# EAGLE design untitled (EAGLE 9.6.2)
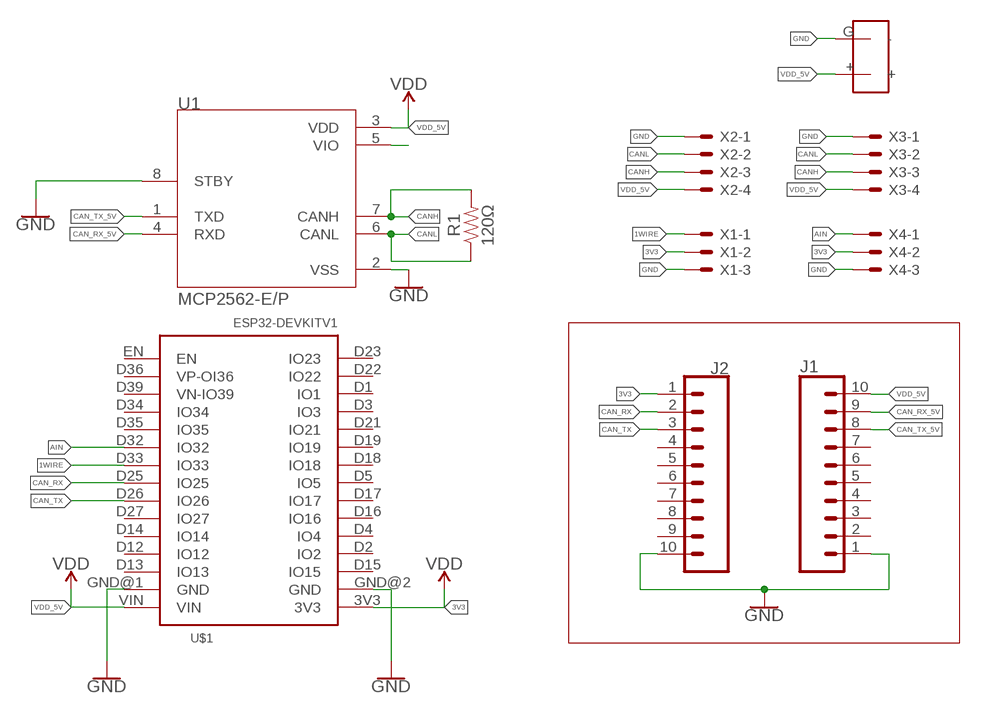
[diagram p0: schematic, sheet 1]

## Parts
J1  CONN_10"  [1X10]
J2  CONN_10"  [1X10]
R1  120Ω  RESISTORAXIAL-0.3  [AXIAL-0.3]
U1  MCP2562-E/P  [DIP787W45P254L1016H533Q8]
U$1  ESP32DEVKITV1  [ESP32-DEVKITV1]
U$2  BAT  [BAT]
X1  JST-XH-03-PIN-LONG-PAD  [JST-XH-03-PACKAGE-LONG-PAD]
X2  JST-XH-04-PIN-LONG-PAD  [JST-XH-04-PACKAGE-LONG-PAD]
X3  JST-XH-04-PIN-LONG-PAD  [JST-XH-04-PACKAGE-LONG-PAD]
X4  JST-XH-03-PIN-LONG-PAD  [JST-XH-03-PACKAGE-LONG-PAD]

## Nets
1WIRE: U$1.D33(IO33) X1.1
3V3: J2.1 U$1.3V3 X1.2 X4.2 ; supply symbol labelled VDD
AIN: U$1.D32(IO32) X4.1
CAN_RX: J2.2 U$1.D25(IO25)
CAN_RX_5V: J1.9 U1.4(RXD)
CAN_TX: J2.3 U$1.D26(IO26)
CAN_TX_5V: J1.8 U1.1(TXD)
CANH: R1.P$2 U1.7(CANH) X2.3 X3.3
CANL: R1.P$1 U1.6(CANL) X2.2 X3.2
GND: J1.1 J2.10 U1.2(VSS) U1.8(STBY) U$1.GND@1(GND) U$1.GND@2(GND) U$2.G(-) X1.3 X2.1 X3.1 X4.3
N$7: U1.5(VIO)
VDD_5V: J1.10 U1.3(VDD) U$1.VIN U$2.+ X2.4 X3.4 ; supply symbol labelled VDD
Unconnected: J1.2 J1.3 J1.4 J1.5 J1.6 J1.7 J2.4 J2.5 J2.6 J2.7 J2.8 J2.9 U$1.D1(IO1) U$1.D2(IO2) U$1.D3(IO3) U$1.D4(IO4) U$1.D5(IO5) U$1.D12(IO12) U$1.D13(IO13) U$1.D14(IO14) U$1.D15(IO15) U$1.D16(IO16) U$1.D17(IO17) U$1.D18(IO18) U$1.D19(IO19) U$1.D21(IO21) U$1.D22(IO22) U$1.D23(IO23) U$1.D27(IO27) U$1.D34(IO34) U$1.D35(IO35) U$1.D36(VP-OI36) U$1.D39(VN-IO39) U$1.EN

## Library data of the parts
J1 J2 = SparkFun-Connectors:CONN_10: Multi connection point. Often used as Generic Header-pin footprint for 0.1 inch spaced/style header connections On any of the 0.1 inch spaced packages, you can populate with these: Break Away Headers - Straight <https://www.sparkfun.com/products/116> (PRT-00116) Break Away Male Headers - Right Angle <https://www.sparkfun.com/products/553> (PRT-00553) Female Headers <https://www.sparkfun.com/products/115> (PRT-00115) Break Away Headers - Machine Pin <https://www.sparkfun.com/products/117> (PRT-00117) Break Away Female Headers - Swiss Machine Pin <https://www.sparkfun.com/products/743> (PRT-00743) Arduino Stackable Header - 10 Pin <https://www.sparkfun.com/products/11376> (PRT-11376) For SCREWTERMINALS and SPRING TERMINALS visit here: Screw Terimnals on SparkFun.com <https://www.sparkfun.com/search/results?term=Screw+Terminals> (5mm/3.5mm/2.54mm spacing) This device is also useful as a general connection point to wire up your design to another part of your project. Our various solder wires solder well into these plated through hole pads. Hook-Up Wire - Assortment (Stranded, 22 AWG) <https://www.sparkfun.com/products/11375> (PRT-11375) Hook-Up Wire - Assortment (Solid Core, 22 AWG) <https://www.sparkfun.com/products/11367> (PRT-11367) View the entire wire category on our website here <https://www.sparkfun.com/categories/141> Special notes: Molex polarized connector foot print use with SKU : PRT-08231 with associated crimp pins and housings. 1MM SMD Version SKU: PRT-10208 NOTES ON THE VARIANTS LOCK and LOCK_LONGPADS... This footprint was designed to help hold the alignment of a through-hole component (i.e. 6-pin header) while soldering it into place. You may notice that each hole has been shifted either up or down by 0.005 of an inch from it's more standard position (which is a perfectly straight line). This slight alteration caused the pins (the squares in the middle) to touch the edges of the holes. Because they are alternating, it causes a "brace" to hold the component in place. 0.005 has proven to be the perfect amount of "off-center" position when using our standard breakaway headers. Although looks a little odd when you look at the bare footprint, once you have a header in there, the alteration is very hard to notice. Also,if you push a header all the way into place, it is covered up entirely on the bottom side.; PROD_ID: CONN-11563
R1 = SparkFun-Resistors:RESISTOR: Generic Resistor Package
U1 = MCP2562-E_P:MCP2562-E/P: Integrated circuit: transceiver CAN; Channels: 1; 1Mbps; DIP8 Check availability <https://pricing.snapeda.com/parts/MCP2562-E/P/Microchip/view-part?ref=eda>; AVAILABILITY: In Stock; DESCRIPTION: 1/1 Transceiver Half CANbus 8-PDIP; MF: Microchip; MP: MCP2562-E/P; PACKAGE: DIP-8 Microchip; PRICE: None; PURCHASE-URL: https://pricing.snapeda.com/search/part/MCP2562-E/P/?ref=eda
U$1 = ESP32-DEVKITV1:ESP32DEVKITV1
U$2 = BAT:BAT
X1 X4 = JST XH Connectors:JST-XH-03-PIN: JST XH Connector 2 Pin Wire to board connector. Pitch: 2,54 mm, (0.100") Number of pins: 3 Created by Rembrandt Electronics www.rembrandtelectronics.com
X2 X3 = JST XH Connectors:JST-XH-04-PIN: JST XH Connector 2 Pin Wire to board connector. Pitch: 2,54 mm, (0.100") Number of pins: 4 Created by Rembrandt Electronics www.rembrandtelectronics.com

## Board
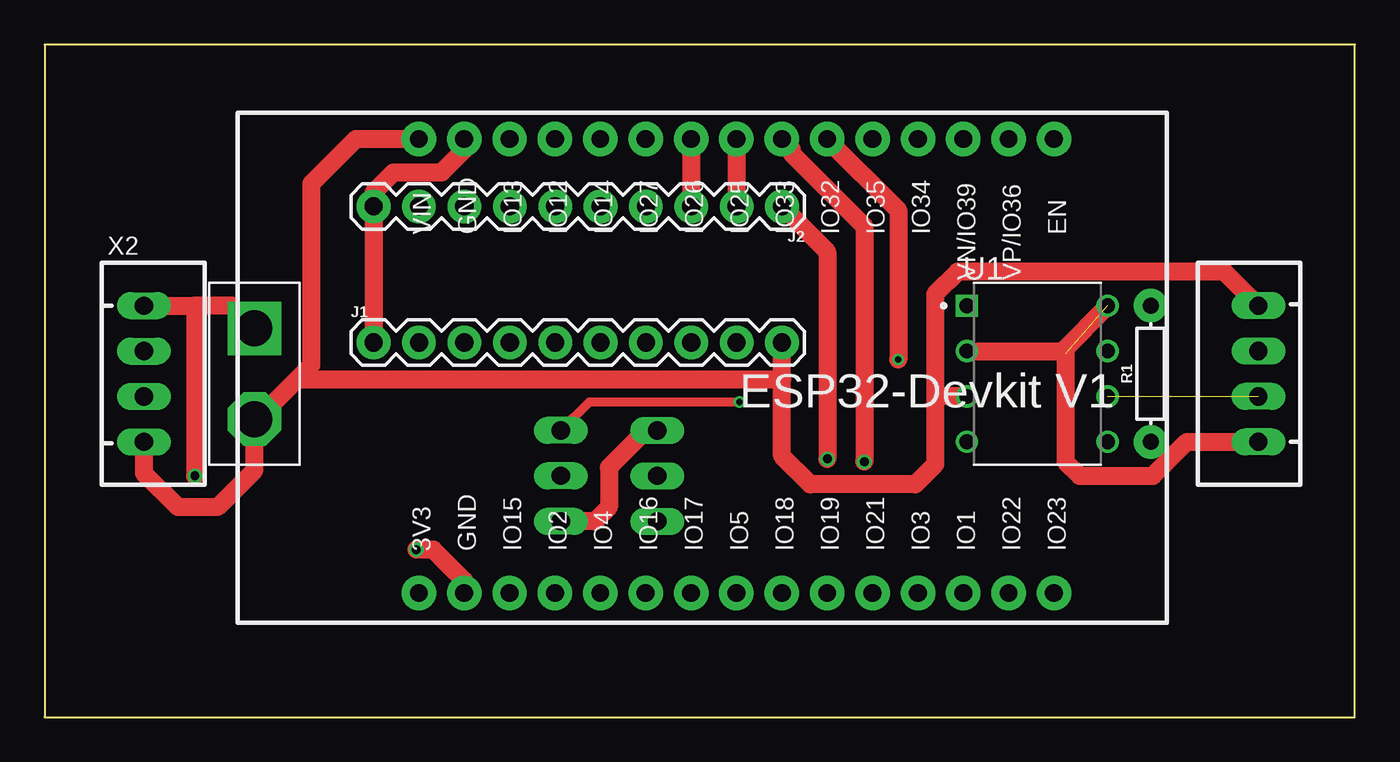
[diagram p1: board, top side]
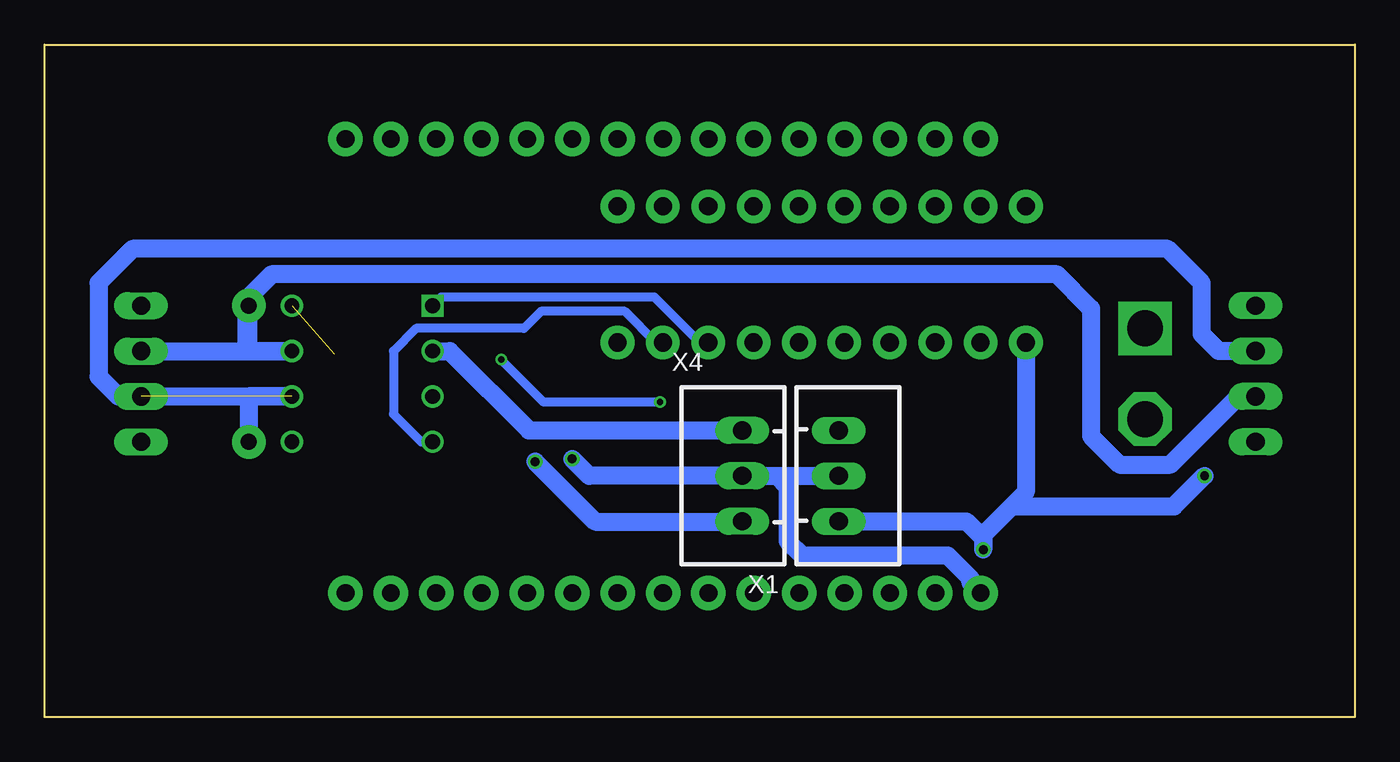
[diagram p2: board, bottom side, seen from below]

Size 73.34 x 37.62 mm. Coordinates in mm from the lower left corner, seen from the top.
Outline: 0,37.62 0,0 73.34,0 73.34,37.62 0,37.62
Copper layers (1*16): Top 0.035mm / dielectric 1.6mm / Bottom 0.035mm
Design rules "Elecrow_2-layer_PCB_eagle_rule": minimum track width 6mil, minimum drill 12mil, track to track 6mil, track to pad 6mil, pad to pad 6mil, via to via 8mil, smd to smd 0mil, copper to edge 20mil, drill to drill 10mil, minimum pad ring 6mil, minimum via ring 6mil, stop-mask expansion 0mil, vias tented up to drill 100mil, thermal gap 10mil

### Footprints (pad centres in the part's own frame; a part is rotated, then mirrored left to right if it is on the bottom)
1X10 = drill 1.016 pad 1.88: 1 0,0; 2 2.54,0; 3 5.08,0; 4 7.62,0; 5 10.16,0; 6 12.7,0; 7 15.24,0; 8 17.78,0; 9 20.32,0; 10 22.86,0
AXIAL-0.3 = drill 0.9 pad 1.88: P$1 -3.81,0; P$2 3.81,0
DIP787W45P254L1016H533Q8 = drill 0.83 square: 1 -3.937,3.81 | drill 0.83: 2 -3.937,1.27; 3 -3.937,-1.27; 4 -3.937,-3.81; 5 3.937,-3.81; 6 3.937,-1.27; 7 3.937,1.27; 8 3.937,3.81
ESP32-DEVKITV1 = drill 1 pad 1.93: 3V3 -16.52,-12.27; D1 13.96,-12.27; D2 -8.9,-12.27; D3 11.42,-12.27; D4 -6.36,-12.27; D5 1.26,-12.27; D12 -8.9,13.135; D13 -11.44,13.135; D14 -6.36,13.135; D15 -11.44,-12.27; D16 -3.82,-12.27; D17 -1.28,-12.27; D18 3.8,-12.27; D19 6.34,-12.27; D21 8.88,-12.27; D22 16.5,-12.27; D23 19.04,-12.27; D25 1.26,13.135; D26 -1.28,13.135; D27 -3.82,13.135; D32 6.34,13.135; D33 3.8,13.135; D34 11.42,13.135; D35 8.88,13.135; D36 16.5,13.135; D39 13.96,13.135; EN 19.04,13.135; GND@1 -13.98,13.135; GND@2 -13.98,-12.27; VIN -16.52,13.135
BAT = drill 2 octagon: + 2.54,0 | drill 2 square: G -2.54,0
JST-XH-03-PACKAGE-LONG-PAD = drill 1.016 long: 1 -2.54,0; 2 0,0; 3 2.54,0
JST-XH-04-PACKAGE-LONG-PAD = drill 1.016 long: 1 -3.81,0; 2 -1.27,0; 3 1.27,0; 4 3.81,0

### Placement (x,y rotation side)
J1  18.41,20.95 0 top
J2  41.27,28.57 180 top
R1  61.91,19.21 90 top
U1  55.56,19.21 0 top
U$1  37.47,19.21 0 top
U$2  11.75,19.21 270 top
X1  34.29,13.49 90 bottom
X2  5.56,19.21 270 top
X3  67.95,19.21 90 top
X4  28.89,13.49 270 bottom

### Tracks (layer width: path | path; a pad name or v marks a point on that pad's centre or on a via)
1WIRE  (via drill 0.5)
  Top 1: U$1.D33 41.83,31.78 41.83,31.53 45.88,27.48 v45.88,14.29
  Bottom 1: X1.1 34.32,10.93 42.52,10.93 v45.88,14.29
3V3  (via drill 0.5)
  Top 1: v43.82,14.45 43.82,26.03 J2.1
  Bottom 1: X1.2 42.86,13.49 v43.82,14.45 | U$1.3V3 21.51,7.5 21.51,7.76 22.8,9.05 30.96,9.05 31.75,9.84 31.75,12.86 32.39,13.49 X1.2 | X1.2 X4.2
AIN  (via drill 0.35)
  Top 0.5: X4.1 30.48,17.62 v38.89,17.62
  Top 1: U$1.D32 47.78,28.36 v47.78,20
  Bottom 0.5: v38.89,17.62 45.4,17.62 v47.78,20
CAN_RX
  Top 1: U$1.D25 38.73,28.58 J2.2
CAN_RX_5V
  Bottom 0.5: J1.9 39.11,20.95 40.86,22.7 45.56,22.7 46.51,21.75 52.55,21.75 53.82,20.48 53.82,16.95 52.26,15.4 U1.4
CAN_TX
  Top 1: U$1.D26 J2.3
CAN_TX_5V
  Bottom 0.5: J1.8 36.67,20.95 39.21,23.49 51.15,23.49 U1.1
CANH
  Bottom 1: R1.P$2 61.91,20.48 U1.7 62.07,20.48 | X3.3 62.07,20.48 | 62.07,20.48 62.07,23.34 60.64,24.76 16.67,24.76 14.76,22.86 14.76,15.72 13.18,14.13 10.32,14.13 6.51,17.94 X2.3
CANL  (1 unrouted)
  Bottom 1: R1.P$1 61.91,17.94 U1.6 X3.2 69.22,17.94 70.33,19.05 70.33,24.29 68.42,26.19 10.48,26.19 8.57,24.29 8.57,21.43 7.62,20.48 X2.2
GND  (via drill 0.5)  (1 unrouted)
  Top 1: X2.1 8.41,23.02 | 8.41,23.02 10.48,23.02 U$2.G | J1.1 J2.10 18.42,29.37 19.53,30.48 22.23,30.48 23.49,31.74 U$1.GND@1 | X1.3 33.66,16.03 31.59,13.97 31.59,11.75 30.8,10.95 X4.3 | U$1.GND@2 23.49,7.63 21.75,9.37 v20.8,9.37 | U1.2 56.99,20.48 59.5,22.99 U1.8 | 8.41,23.02 v8.41,13.49 | X3.1 63.94,15.4 62.04,13.49 57.94,13.49 57.15,14.29 57.15,20.32
  Bottom 1: J1.1 18.42,12.58 19.21,11.79 | 19.21,11.79 20.8,10.2 v20.8,9.37 20.8,10 21.75,10.95 X4.3 | X1.3 46.23,16.03 50.67,20.48 U1.2 | 19.21,11.79 10.12,11.79 v8.41,13.49
VDD_5V
  Top 1: X2.4 5.56,13.65 7.46,11.75 9.68,11.75 11.75,13.81 U$2.+ 11.91,16.67 14.13,18.89 | U$1.VIN 17.42,32.34 14.92,29.84 14.92,19.68 14.13,18.89 | 41.28,18.89 J1.10 | X3.4 66.04,24.92 51.12,24.92 49.85,23.65 49.85,17.94 | 14.13,18.89 41.28,18.89 | 41.28,18.89 41.28,14.6 42.86,13.02 48.74,13.02 49.85,14.13 49.85,17.94 | U1.3 49.85,17.94